# Altium schematic sheet ble.SchDoc
size A4
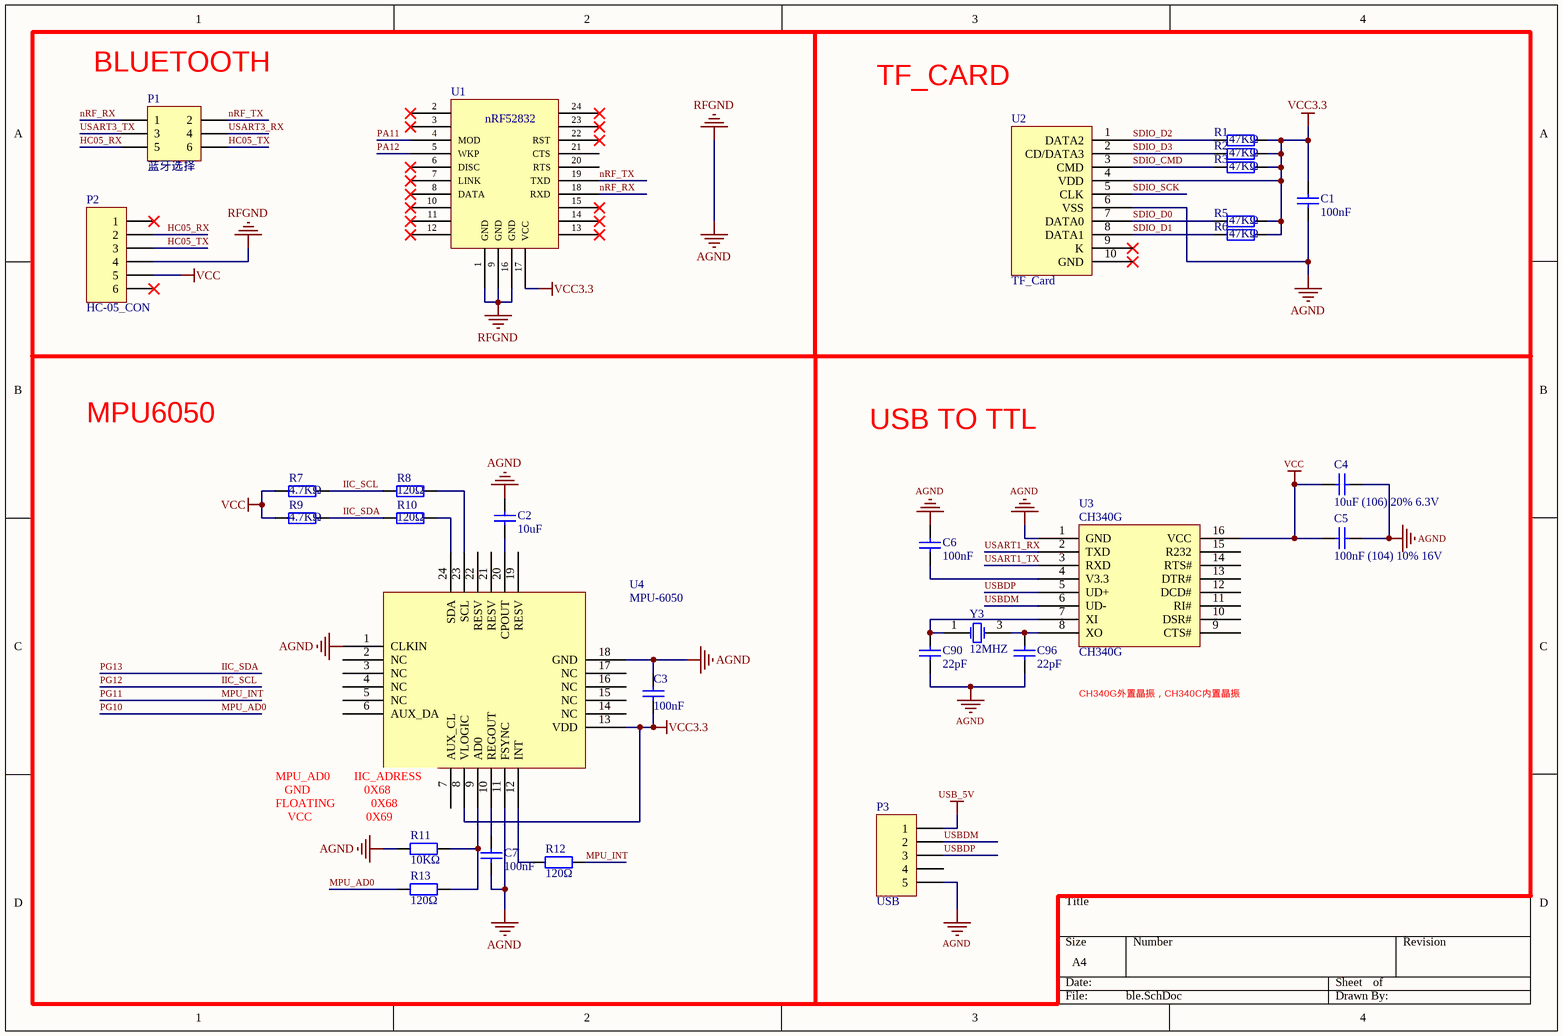
[diagram p0: ble.SchDoc]

## Parts
C1  100nF  [0402_C]
C2  10uF  [0402_C]
C3  100nF  [0402_C]
C4  10uF (106) 20% 6.3V  [0402_C]
C5  100nF (104) 10% 16V  [0402_C]
C6  100nF  [0402_C]
C7  100nF  [0402_C]
C90  22pF  [0402_C]
C96  22pF  [0402_C]
P1  蓝牙选择  [HDR2X3]
P2  HC-05_CON  [HDR1X6]
P3  USB  [MICRO-USB]
R1  47KΩ  [0402_R]
R2  47KΩ  [0402_R]
R3  47KΩ  [0402_R]
R5  47KΩ  [0402_R]
R6  47KΩ  [0402_R]
R7  4.7KΩ  [0402_R]
R8  120Ω  [0402_R]
R9  4.7KΩ  [0402_R]
R10  120Ω  [0402_R]
R11  10KΩ  [0402_R]
R12  120Ω  [0402_R]
R13  120Ω  [0402_R]
U1  nRF52832  [nRF52832]
U2  TF_Card  [TF_1]
U3  CH340G  [SOIC-16_150mil]
U4  MPU-6050  [QFN-24_4x4x05P]
Y3  12MHZ  [SMD-3225_4P]

## Nets
AGND: C1.1 C2.2 C3.2 C4.2 C5.2 C6.2 C7.1 C90.1 C96.1 P2.4 P3.5 R11.2 U1.1(GND) U1.9(GND) U1.16(GND) U2.6(VSS) U3.1(GND) U4.1(CLKIN) U4.11(FSYNC) U4.18(GND)  [also labelled RFGND]
USB_5V: P3.1
VCC: C4.1 C5.1 P2.5 R7.1 R9.1 U3.16(VCC)
VCC3.3: C1.2 C3.1 R1.2 R2.2 R3.2 R5.2 R6.2 U1.17(VCC) U2.4(VDD) U4.8(VLOGIC) U4.13(VDD)
HC05_RX: P1.5 P2.2
HC05_TX: P1.6 P2.3
IIC_SCL: R7.2 R8.2  [also labelled PG12]
IIC_SDA: R9.2 R10.2  [also labelled PG13]
MPU_AD0: R13.2  [also labelled PG10]
MPU_INT: R12.1  [also labelled PG11]
nRF_RX: P1.1 U1.18(RXD)
nRF_TX: P1.2 U1.19(TXD)
PA11: U1.4(MOD)
PA12: U1.5(WKP)
SDIO_CMD: R3.1 U2.3(CMD)
SDIO_D0: R5.1 U2.7(DATA0)
SDIO_D1: R6.1 U2.8(DATA1)
SDIO_D2: R1.1 U2.1(DATA2)
SDIO_D3: R2.1 U2.2(CD/DATA3)
SDIO_SCK: U2.5(CLK)
USART1_RX: U3.2(TXD)
USART1_TX: U3.3(RXD)
USART3_RX: P1.4
USART3_TX: P1.3
USBDM: P3.2 U3.6(UD-)
USBDP: P3.3 U3.5(UD+)
NetC2_1: C2.1 U4.20(CPOUT)
NetC6_1: C6.1 U3.4(V3.3)
NetC7_2: C7.2 U4.10(REGOUT)
NetC90_2: C90.2 U3.7(XI) Y3.1(OSC1)
NetC96_2: C96.2 U3.8(XO) Y3.3(OSC2)
NetR8_1: R8.1 U4.23(SCL)
NetR10_1: R10.1 U4.24(SDA)
NetR11_1: R11.1 R13.1 U4.9(AD0)
NetR12_2: R12.2 U4.12(INT)

Not connected (* = marked no-connect by the designer): P2 1* 6*; P3 4; U1 2* 3* 6(DISC)* 7(LINK)* 8(DATA)* 10* 11* 12* 13* 14* 15* 20(RTS) 21(CTS) 22(RST)* 23* 24*; U2 9(K)* 10(GND)*; U3 9(CTS#) 10(DSR#) 11(RI#) 12(DCD#) 13(DTR#) 14(RTS#) 15(R232); U4 2(NC) 3(NC) 4(NC) 5(NC) 6(AUX_DA) 7(AUX_CL) 14(NC) 15(NC) 16(NC) 17(NC) 19(RESV) 21(RESV) 22(RESV)

## Notes on the sheet
- (near P1) BLUETOOTH
- TF_CARD
- MPU6050
- USB TO TTL
- CH340G外置晶振，CH340C内置晶振
- (near U4) MPU_AD0        IIC_ADRESS
  GND                  0X68
  FLOATING            0X68
  VCC                  0X69

## Library data of the parts
C1 C3 C5-C7 = 0402 100nF (104) 10% 16V: 贴片电容; ComponentLink1Description: 供应商链接; ComponentLink1URL: http://www.szlcsc.com/product/details_1877.html; Package: 0402; Supplier: LC; SuppliersPartNumber: C1525
C2 C4 = 0402 10uF (106) 20% 6.3V: 贴片电容; ComponentLink1Description: 供应商链接; ComponentLink1URL: http://www.szlcsc.com/product/details_16204.html; Package: 0402; Supplier: LC; SuppliersPartNumber: C15525
C90 C96 = 0402 22pF (220) 5% 50V: 贴片电容; ComponentLink1Description: 供应商链接; ComponentLink1URL: http://www.szlcsc.com/product/details_1907.html; Package: 0402; Supplier: LC; SuppliersPartNumber: C1555
P1 = Header 3X2: Header, 3-Pin, Dual row; LatestRevisionDate: 17-Jul-2002; LatestRevisionNote: Re-released for DXP Platform.; Publisher: Altium Limited
P2 = Header 6: Header, 6-Pin; LatestRevisionDate: 17-Jul-2002; LatestRevisionNote: Re-released for DXP Platform.; Publisher: Altium Limited
P3 = Header 5: Header, 5-Pin; LatestRevisionDate: 17-Jul-2002; LatestRevisionNote: Re-released for DXP Platform.; Publisher: Altium Limited
R1-R3 R5 R6 = 0402 47KΩ (4702) 1%: 贴片电阻; ComponentLink1Description: 供应商链接; ComponentLink1URL: http://www.szlcsc.com/product/details_26535.html; Package: 0402; Supplier: LC; SuppliersPartNumber: C25792
R7 R9 = 0402 4.7KΩ (4701) 1%: 贴片电阻; ComponentLink1Description: 供应商链接; ComponentLink1URL: http://www.szlcsc.com/product/details_26643.html; Package: 0402; Supplier: LC; SuppliersPartNumber: C25900
R8 R10 R12 R13 = 0402 120Ω (1200) 1%: 贴片电阻; ComponentLink1Description: 供应商链接; ComponentLink1URL: http://www.szlcsc.com/product/details_25822.html; Package: 0402; Supplier: LC; SuppliersPartNumber: C25079
R11 = 0402 10KΩ (1002) 1%: 贴片电阻; ComponentLink1Description: 供应商链接; ComponentLink1URL: http://www.szlcsc.com/product/details_26487.html; Package: 0402; Supplier: LC; SuppliersPartNumber: C25744
U3 = CH340G_[C14267]: USB; ComponentLink1Description: 供应商链接; ComponentLink1URL: http://www.szlcsc.com/product/details_14927.html; Package: SOIC-16_150mil; Supplier: LC; SuppliersPartNumber: C14267
U4 = MPU-6050_[C24112]: 传感器; ComponentLink1Description: 供应商链接; ComponentLink1URL: http://www.szlcsc.com/product/details_24852.html; Package: QFN-24_4x4x05P; Supplier: LC; SuppliersPartNumber: C24112
Y3 = SMD-3225_4P  12MHZ 20PF 10PPM: 贴片晶振; ComponentLink1Description: 供应商链接; ComponentLink1URL: http://www.szlcsc.com/product/details_9522.html; Package: SMD-3225_4P; Supplier: LC; SuppliersPartNumber: C9002